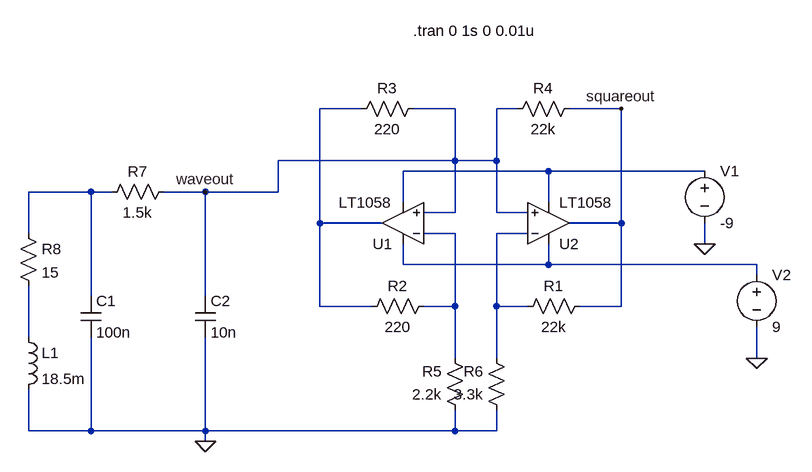
[diagram p0: schematic ChuaCircuit_works_testing.asc]
ChuaCircuit_works_testing.asc, the LTspice schematic file:
Version 4
SHEET 1 1052 680
WIRE 336 -32 272 -32
WIRE 480 -32 416 -32
WIRE 576 -32 544 -32
WIRE 736 -32 656 -32
WIRE 480 48 480 -32
WIRE 480 48 208 48
WIRE 544 48 544 -32
WIRE 544 48 480 48
WIRE 624 64 400 64
WIRE 864 64 624 64
WIRE -80 96 -176 96
WIRE -48 96 -80 96
WIRE 96 96 32 96
WIRE 208 96 208 48
WIRE 208 96 96 96
WIRE 400 112 400 64
WIRE 624 112 624 64
WIRE 480 128 480 48
WIRE 480 128 432 128
WIRE 544 128 544 48
WIRE 592 128 544 128
WIRE 272 144 272 -32
WIRE 368 144 272 144
WIRE 736 144 736 -32
WIRE 736 144 656 144
WIRE -176 160 -176 96
WIRE 480 160 432 160
WIRE 592 160 544 160
WIRE 864 176 864 144
WIRE 400 208 400 176
WIRE 624 208 624 176
WIRE 624 208 400 208
WIRE 944 208 624 208
WIRE 944 224 944 208
WIRE -80 256 -80 96
WIRE 96 256 96 96
WIRE 272 272 272 144
WIRE 352 272 272 272
WIRE 480 272 480 160
WIRE 480 272 432 272
WIRE 544 272 544 160
WIRE 592 272 544 272
WIRE 736 272 736 144
WIRE 736 272 672 272
WIRE -176 320 -176 240
WIRE 480 352 480 272
WIRE 544 352 544 272
WIRE 944 352 944 304
WIRE -176 464 -176 400
WIRE -80 464 -80 320
WIRE -80 464 -176 464
WIRE 96 464 96 320
WIRE 96 464 -80 464
WIRE 480 464 480 432
WIRE 480 464 96 464
WIRE 544 464 544 432
WIRE 544 464 480 464
WIRE 96 480 96 464
FLAG 96 480 0
FLAG 864 176 0
FLAG 944 352 0
FLAG 96 96 waveout
FLAG 736 -32 squareout
SYMBOL LT1058 400 208 R180
SYMATTR InstName U1
SYMBOL LT1058 624 208 M180
SYMATTR InstName U2
SYMBOL res 688 256 R90
WINDOW 0 0 56 VBottom 2
WINDOW 3 32 56 VTop 2
SYMATTR InstName R1
SYMATTR Value 22k
SYMBOL res 448 256 R90
WINDOW 0 0 56 VBottom 2
WINDOW 3 32 56 VTop 2
SYMATTR InstName R2
SYMATTR Value 220
SYMBOL res 432 -48 R90
WINDOW 0 0 56 VBottom 2
WINDOW 3 32 56 VTop 2
SYMATTR InstName R3
SYMATTR Value 220
SYMBOL res 672 -48 R90
WINDOW 0 0 56 VBottom 2
WINDOW 3 32 56 VTop 2
SYMATTR InstName R4
SYMATTR Value 22k
SYMBOL res 496 448 R180
WINDOW 0 36 76 Left 2
WINDOW 3 36 40 Left 2
SYMATTR InstName R5
SYMATTR Value 2.2k
SYMBOL res 560 448 R180
WINDOW 0 36 76 Left 2
WINDOW 3 36 40 Left 2
SYMATTR InstName R6
SYMATTR Value 3.3k
SYMBOL res -64 112 R270
WINDOW 0 32 56 VTop 2
WINDOW 3 0 56 VBottom 2
SYMATTR InstName R7
SYMATTR Value 1.5k
SYMBOL res -192 144 R0
SYMATTR InstName R8
SYMATTR Value 15
SYMBOL cap -96 256 R0
SYMATTR InstName C1
SYMATTR Value 100n
SYMBOL cap 80 256 R0
SYMATTR InstName C2
SYMATTR Value 10n
SYMBOL ind -192 304 R0
SYMATTR InstName L1
SYMATTR Value 18.5m
SYMBOL voltage 864 48 R0
SYMATTR InstName V1
SYMATTR Value -9
SYMBOL voltage 944 208 R0
SYMATTR InstName V2
SYMATTR Value 9
TEXT 416 -152 Left 2 !.tran 0 1s 0 0.01u

The netlist it stands for:
* ChuaCircuit_works_testing.asc
XU1 waveout N004 N006 N002 N001 LT1057  ; LT1058, pins In+ In- V+ V- OUT
XU2 waveout N005 N006 N002 squareout LT1057  ; LT1058, pins In+ In- V+ V- OUT
R1 squareout N005 22k
R2 N004 N001 220
R3 waveout N001 220
R4 squareout waveout 22k
R5 0 N004 2.2k
R6 0 N005 3.3k
R7 N003 waveout 1.5k
R8 N003 N007 15
C1 N003 0 100n
C2 waveout 0 10n
L1 N007 0 18.5m
V1 N002 0 -9
V2 N006 0 9
.tran 0 1s 0 0.01u
.lib LTC.lib
.backanno
.end